# Altium schematic sheet Mechanical Info.SchDoc: Mechanical Information
size A4; Title2: NASCO ALARM INTERFACE
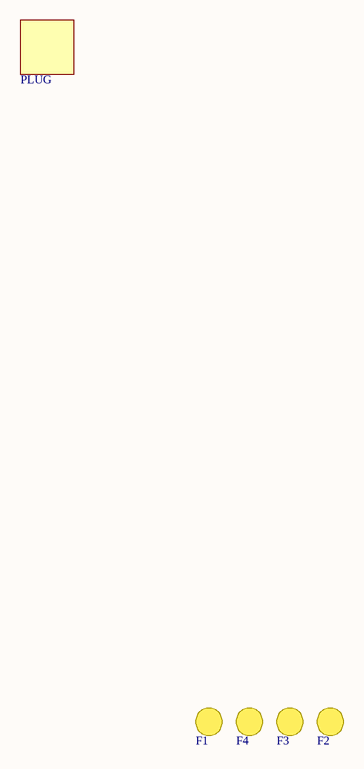
[diagram p0: Mechanical Info.SchDoc]

## Parts
?  (no value)  (no BOM)
F1  Fiducial  [Fiducial]  (value not drawn)  (no BOM)
F2  Fiducial  [Fiducial]  (value not drawn)  (no BOM)
F3  Fiducial  [Fiducial]  (value not drawn)  (no BOM)
F4  Fiducial  [Fiducial]  (value not drawn)  (no BOM)
PLUG  PLUG  (value not drawn)

## Notes on the sheet
- Title
- NASCO
- Size:
- Date:
- A4
- Number:
- Revision:
- Sheet
- of
- File:

## Library data of the parts
? = NASCO_LOGO: LOGO
F1-F4 = Fiducial: Manufacturer: N/A - PCB ARTWORK; Manufacturer Part No.: N/A
PLUG = PLUG: Manufacturer: Phoenix Contact; Manufacturer Part No.: 1757019; value: 1757019; Mouser Part no.: 651-1757019; Web link: http://au.mouser.com/ProductDetail/Phoenix-Contact/1757019/?qs=sGAEpiMZZMvlX3nhDDO4AGmxTE5dWGQY3FmaBdjJUN0%3d